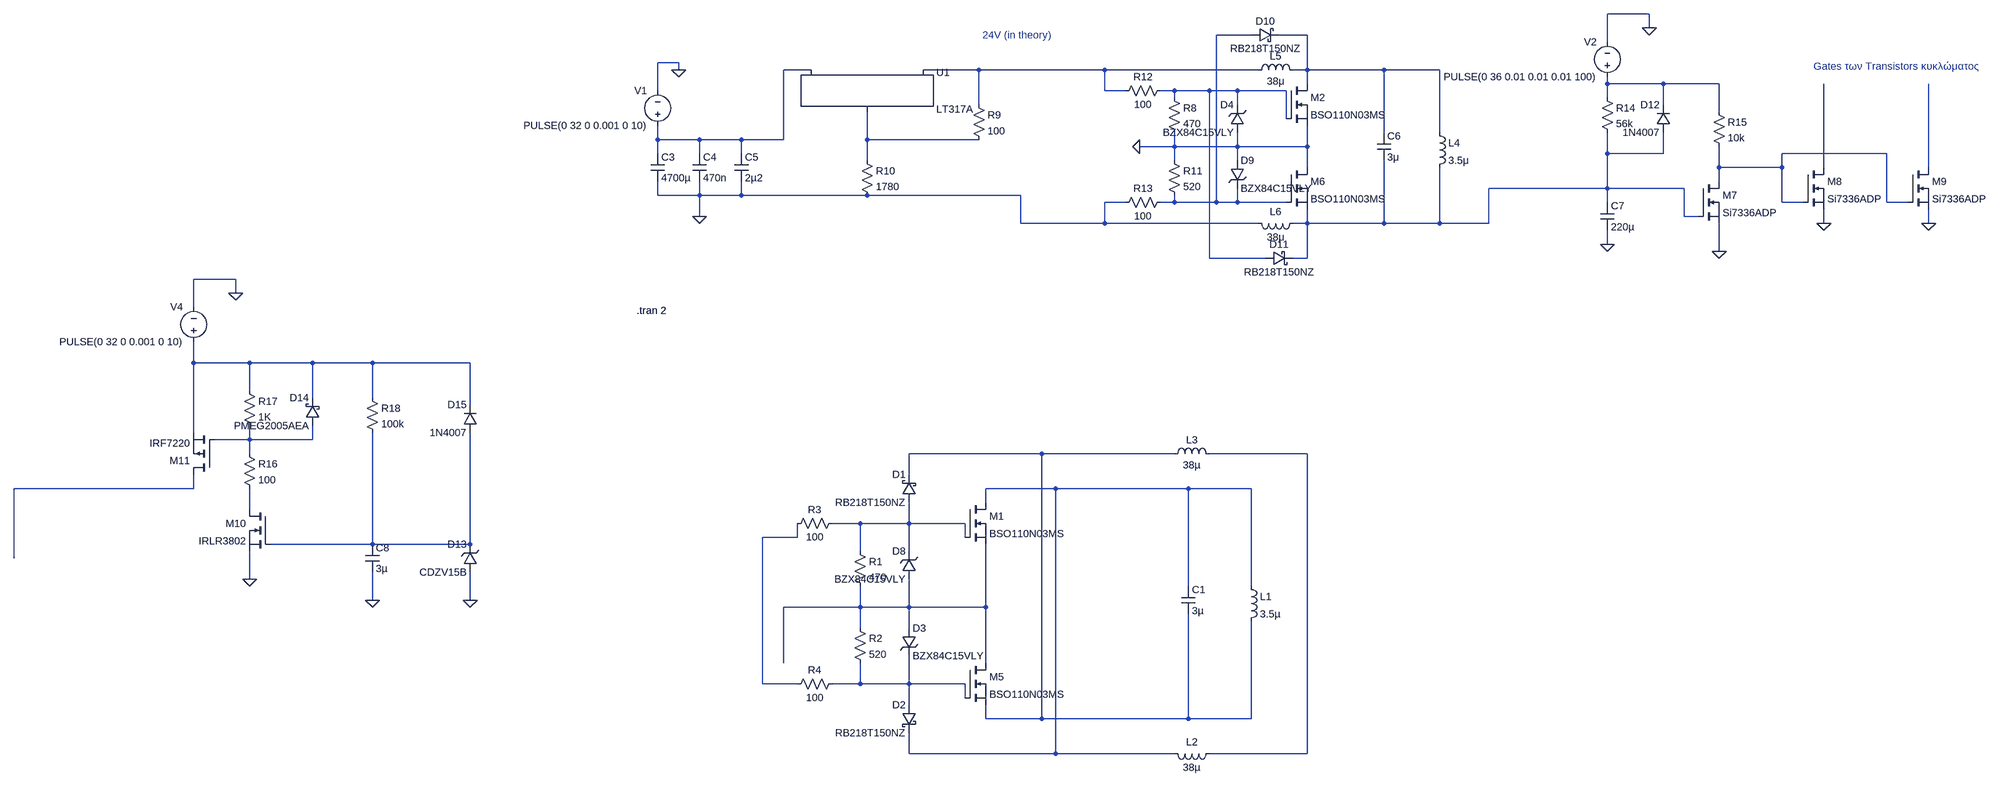
[diagram p0: schematic new_combined_stillwrong.asc]
new_combined_stillwrong.asc, the LTspice schematic file:
Version 4.1
SHEET 1 2732 1648
WIRE 656 -96 560 -96
WIRE 656 -64 656 -96
WIRE -256 -48 -336 -48
WIRE -128 -48 -192 -48
WIRE 560 -32 560 -96
WIRE -1568 16 -1616 16
WIRE -1568 32 -1568 16
WIRE -1264 32 -1328 32
WIRE -880 32 -1008 32
WIRE -592 32 -880 32
WIRE -240 32 -592 32
WIRE -128 32 -128 -48
WIRE -128 32 -160 32
WIRE 48 32 -128 32
WIRE 176 32 48 32
WIRE -128 64 -128 32
WIRE 560 64 560 48
WIRE 688 64 560 64
WIRE 816 64 688 64
WIRE -1616 80 -1616 16
WIRE -592 80 -592 32
WIRE -544 80 -592 80
WIRE -432 80 -464 80
WIRE -352 80 -432 80
WIRE -288 80 -352 80
WIRE -176 80 -288 80
WIRE -432 96 -432 80
WIRE 560 96 560 64
WIRE -880 112 -880 32
WIRE -288 112 -288 80
WIRE 688 112 688 64
WIRE 816 128 816 64
WIRE -176 144 -176 80
WIRE 48 176 48 32
WIRE 176 176 176 32
WIRE -1616 192 -1616 160
WIRE -1520 192 -1616 192
WIRE -1424 192 -1520 192
WIRE -1328 192 -1328 32
WIRE -1328 192 -1424 192
WIRE -1136 192 -1136 128
WIRE -880 192 -1136 192
WIRE -432 208 -432 176
WIRE -432 208 -512 208
WIRE -288 208 -288 176
WIRE -288 208 -432 208
WIRE -128 208 -128 160
WIRE -128 208 -288 208
WIRE -1616 224 -1616 192
WIRE -1520 224 -1520 192
WIRE -1424 224 -1424 192
WIRE 560 224 560 176
WIRE 688 224 688 176
WIRE 688 224 560 224
WIRE 1200 224 960 224
WIRE -1136 240 -1136 192
WIRE -432 240 -432 208
WIRE -288 240 -288 208
WIRE -128 256 -128 208
WIRE 816 256 816 208
WIRE 960 256 960 224
WIRE 960 256 816 256
WIRE 1056 256 1056 64
WIRE 1296 256 1296 64
WIRE 816 288 816 256
WIRE 560 304 560 224
WIRE 560 304 288 304
WIRE 736 304 560 304
WIRE -1616 320 -1616 288
WIRE -1520 320 -1520 288
WIRE -1520 320 -1616 320
WIRE -1424 320 -1424 288
WIRE -1424 320 -1520 320
WIRE -1136 320 -1424 320
WIRE -784 320 -1136 320
WIRE -544 336 -592 336
WIRE -432 336 -432 320
WIRE -432 336 -464 336
WIRE -336 336 -336 -48
WIRE -336 336 -432 336
WIRE -288 336 -288 304
WIRE -288 336 -336 336
WIRE -176 336 -288 336
WIRE 560 336 560 304
WIRE 960 336 960 256
WIRE 1008 336 960 336
WIRE 1200 336 1200 224
WIRE 1248 336 1200 336
WIRE -1520 368 -1520 320
WIRE 736 368 736 304
WIRE 768 368 736 368
WIRE -784 384 -784 320
WIRE -592 384 -592 336
WIRE -592 384 -784 384
WIRE -240 384 -592 384
WIRE -128 384 -128 352
WIRE -128 384 -160 384
WIRE 48 384 48 240
WIRE 48 384 -128 384
WIRE 176 384 176 256
WIRE 176 384 48 384
WIRE 288 384 288 304
WIRE 288 384 176 384
WIRE 1056 384 1056 352
WIRE 1296 384 1296 352
WIRE 560 432 560 400
WIRE 816 448 816 384
WIRE -352 464 -352 80
WIRE -224 464 -352 464
WIRE -128 464 -128 384
WIRE -128 464 -160 464
WIRE -2608 512 -2704 512
WIRE -2608 544 -2608 512
WIRE -2704 576 -2704 512
WIRE -2704 704 -2704 656
WIRE -2576 704 -2704 704
WIRE -2432 704 -2576 704
WIRE -2288 704 -2432 704
WIRE -2064 704 -2288 704
WIRE -2576 768 -2576 704
WIRE -2432 784 -2432 704
WIRE -2288 784 -2288 704
WIRE -2064 800 -2064 704
WIRE -2704 864 -2704 704
WIRE -2576 880 -2576 848
WIRE -2576 880 -2656 880
WIRE -2432 880 -2432 848
WIRE -2432 880 -2576 880
WIRE -2576 912 -2576 880
WIRE -736 912 -1040 912
WIRE -432 912 -736 912
WIRE -128 912 -352 912
WIRE -1040 960 -1040 912
WIRE -2704 992 -2704 960
WIRE -2704 992 -3216 992
WIRE -704 992 -864 992
WIRE -400 992 -704 992
WIRE -256 992 -400 992
WIRE -864 1024 -864 992
WIRE -2576 1040 -2576 992
WIRE -1152 1072 -1216 1072
WIRE -1040 1072 -1040 1024
WIRE -1040 1072 -1152 1072
WIRE -912 1072 -1040 1072
WIRE -1296 1104 -1296 1072
WIRE -1296 1104 -1376 1104
WIRE -912 1104 -912 1072
WIRE -2288 1120 -2288 864
WIRE -2288 1120 -2528 1120
WIRE -2064 1120 -2064 864
WIRE -2064 1120 -2288 1120
WIRE -1152 1136 -1152 1072
WIRE -1040 1136 -1040 1072
WIRE -3216 1152 -3216 992
WIRE -2576 1200 -2576 1136
WIRE -400 1216 -400 992
WIRE -256 1216 -256 992
WIRE -2288 1248 -2288 1184
WIRE -2064 1248 -2064 1184
WIRE -1152 1264 -1152 1216
WIRE -1152 1264 -1328 1264
WIRE -1040 1264 -1040 1200
WIRE -1040 1264 -1152 1264
WIRE -864 1264 -864 1120
WIRE -864 1264 -1040 1264
WIRE -1152 1312 -1152 1264
WIRE -1040 1312 -1040 1264
WIRE -1328 1392 -1328 1264
WIRE -864 1392 -864 1264
WIRE -1376 1440 -1376 1104
WIRE -1296 1440 -1376 1440
WIRE -1152 1440 -1152 1392
WIRE -1152 1440 -1216 1440
WIRE -1040 1440 -1040 1376
WIRE -1040 1440 -1152 1440
WIRE -912 1440 -1040 1440
WIRE -912 1472 -912 1440
WIRE -1040 1488 -1040 1440
WIRE -864 1520 -864 1488
WIRE -736 1520 -736 912
WIRE -736 1520 -864 1520
WIRE -400 1520 -400 1280
WIRE -400 1520 -736 1520
WIRE -256 1520 -256 1296
WIRE -256 1520 -400 1520
WIRE -1040 1600 -1040 1552
WIRE -704 1600 -704 992
WIRE -704 1600 -1040 1600
WIRE -432 1600 -704 1600
WIRE -128 1600 -128 912
WIRE -128 1600 -352 1600
FLAG -1568 32 0
FLAG -1520 368 0
FLAG -512 208 0
FLAG 656 -64 0
FLAG 560 432 0
FLAG 816 448 0
FLAG 1296 384 0
FLAG 1056 384 0
FLAG -2576 1200 0
FLAG -2288 1248 0
FLAG -2064 1248 0
FLAG -2608 544 0
SYMBOL cap -416 1216 R0
SYMATTR InstName C1
SYMATTR Value 3µ
SYMBOL ind -272 1200 R0
SYMATTR InstName L1
SYMATTR Value 3.5µ
SYMBOL ind -336 1584 R90
WINDOW 0 5 56 VBottom 2
WINDOW 3 32 56 VTop 2
SYMATTR InstName L2
SYMATTR Value 38µ
SYMBOL ind -448 928 R270
WINDOW 0 32 56 VTop 2
WINDOW 3 5 56 VBottom 2
SYMATTR InstName L3
SYMATTR Value 38µ
SYMBOL nmos -912 1024 R0
SYMATTR InstName M1
SYMATTR Value BSO110N03MS
SYMBOL schottky -1024 1024 R180
WINDOW 0 24 64 Left 2
WINDOW 3 24 0 Left 2
SYMATTR InstName D1
SYMATTR Value RB218T150NZ
SYMATTR Description Diode
SYMATTR Type diode
SYMBOL res -1168 1120 R0
SYMATTR InstName R1
SYMATTR Value 470
SYMBOL res -1168 1296 R0
SYMATTR InstName R2
SYMATTR Value 520
SYMBOL res -1200 1056 R90
WINDOW 0 0 56 VBottom 2
WINDOW 3 32 56 VTop 2
SYMATTR InstName R3
SYMATTR Value 100
SYMBOL res -1200 1424 R90
WINDOW 0 0 56 VBottom 2
WINDOW 3 32 56 VTop 2
SYMATTR InstName R4
SYMATTR Value 100
SYMBOL cap -1632 224 R0
SYMATTR InstName C3
SYMATTR Value 4700µ
SYMBOL cap -1536 224 R0
SYMATTR InstName C4
SYMATTR Value 470n
SYMBOL cap -1440 224 R0
SYMATTR InstName C5
SYMATTR Value 2µ2
SYMBOL res -896 96 R0
SYMATTR InstName R9
SYMATTR Value 100
SYMBOL PowerProducts\\LT317A -1136 32 R0
SYMATTR InstName U1
SYMBOL res -1152 224 R0
SYMATTR InstName R10
SYMATTR Value 1780
SYMBOL nmos -912 1392 R0
SYMATTR InstName M5
SYMATTR Value BSO110N03MS
SYMBOL voltage -1616 176 R180
WINDOW 0 24 96 Left 2
WINDOW 3 24 16 Left 2
WINDOW 123 0 0 Left 0
WINDOW 39 0 0 Left 0
SYMATTR InstName V1
SYMATTR Value PULSE(0 32 0 0.001 0 10)
SYMBOL schottky -1024 1488 M0
SYMATTR InstName D2
SYMATTR Value RB218T150NZ
SYMATTR Description Diode
SYMATTR Type diode
SYMBOL zener -1024 1200 R180
WINDOW 0 24 64 Left 2
WINDOW 3 24 0 Left 2
SYMATTR InstName D8
SYMATTR Value BZX84C15VLY
SYMATTR Description Diode
SYMATTR Type diode
SYMBOL zener -1056 1312 R0
SYMATTR InstName D3
SYMATTR Value BZX84C15VLY
SYMATTR Description Diode
SYMATTR Type diode
SYMBOL cap 32 176 R0
SYMATTR InstName C6
SYMATTR Value 3μ
SYMBOL ind 160 160 R0
SYMATTR InstName L4
SYMATTR Value 3.5μ
SYMATTR SpiceLine Rser=1m
SYMBOL nmos -176 64 R0
SYMATTR InstName M2
SYMATTR Value BSO110N03MS
SYMBOL nmos -176 256 R0
SYMATTR InstName M6
SYMATTR Value BSO110N03MS
SYMBOL zener -272 176 R180
WINDOW 0 24 64 Left 2
WINDOW 3 24 0 Left 2
SYMATTR InstName D4
SYMATTR Value BZX84C15VLY
SYMATTR Description Diode
SYMATTR Type diode
SYMBOL zener -304 240 R0
SYMATTR InstName D9
SYMATTR Value BZX84C15VLY
SYMATTR Description Diode
SYMATTR Type diode
SYMBOL ind -256 48 R270
WINDOW 0 32 56 VTop 2
WINDOW 3 5 56 VBottom 2
SYMATTR InstName L5
SYMATTR Value 38μ
SYMATTR SpiceLine Rser=1m
SYMBOL ind -144 368 R90
WINDOW 0 5 56 VBottom 2
WINDOW 3 32 56 VTop 2
SYMATTR InstName L6
SYMATTR Value 38μ
SYMATTR SpiceLine Rser=1m
SYMBOL res -448 80 R0
SYMATTR InstName R8
SYMATTR Value 470
SYMBOL res -448 224 R0
SYMATTR InstName R11
SYMATTR Value 520
SYMBOL res -448 64 R90
WINDOW 0 0 56 VBottom 2
WINDOW 3 32 56 VTop 2
SYMATTR InstName R12
SYMATTR Value 100
SYMBOL res -448 320 R90
WINDOW 0 0 56 VBottom 2
WINDOW 3 32 56 VTop 2
SYMATTR InstName R13
SYMATTR Value 100
SYMBOL schottky -256 -32 R270
WINDOW 0 32 32 VTop 2
WINDOW 3 0 32 VBottom 2
SYMATTR InstName D10
SYMATTR Value RB218T150NZ
SYMATTR Description Diode
SYMATTR Type diode
SYMBOL schottky -224 448 M90
WINDOW 0 0 32 VBottom 2
WINDOW 3 32 32 VTop 2
SYMATTR InstName D11
SYMATTR Value RB218T150NZ
SYMATTR Description Diode
SYMATTR Type diode
SYMBOL voltage 560 64 R180
WINDOW 0 24 96 Left 2
WINDOW 3 24 16 Left 2
WINDOW 123 0 0 Left 0
WINDOW 39 0 0 Left 0
SYMATTR InstName V2
SYMATTR Value PULSE(0 36 0.01 0.01 0.01 100)
SYMBOL res 544 80 R0
SYMATTR InstName R14
SYMATTR Value 56k
SYMBOL diode 704 176 R180
WINDOW 0 24 64 Left 2
WINDOW 3 24 0 Left 2
SYMATTR InstName D12
SYMATTR Value 1N4007
SYMBOL res 800 112 R0
SYMATTR InstName R15
SYMATTR Value 10k
SYMBOL cap 544 336 R0
SYMATTR InstName C7
SYMATTR Value 220µ
SYMBOL nmos 768 288 R0
SYMATTR InstName M7
SYMATTR Value Si7336ADP
SYMBOL nmos 1008 256 R0
SYMATTR InstName M8
SYMATTR Value Si7336ADP
SYMBOL nmos 1248 256 R0
SYMATTR InstName M9
SYMATTR Value Si7336ADP
SYMBOL cap -2304 1120 R0
SYMATTR InstName C8
SYMATTR Value 3µ
SYMATTR SpiceLine V=50 Irms=10.2 Rser=0.027 Lser=0
SYMBOL zener -2048 1184 R180
WINDOW 0 24 64 Left 2
WINDOW 3 24 0 Left 2
SYMATTR InstName D13
SYMATTR Value CDZV15B
SYMATTR Description Diode
SYMATTR Type diode
SYMBOL nmos -2528 1040 M0
SYMATTR InstName M10
SYMATTR Value IRLR3802
SYMBOL res -2592 896 R0
SYMATTR InstName R16
SYMATTR Value 100
SYMATTR SpiceLine tol=1 pwr=0.1
SYMBOL res -2592 752 R0
SYMATTR InstName R17
SYMATTR Value 1K
SYMATTR SpiceLine tol=1 pwr=0.1
SYMBOL schottky -2416 848 R180
WINDOW 0 24 64 Left 2
WINDOW 3 24 0 Left 2
SYMATTR InstName D14
SYMATTR Value PMEG2005AEA
SYMATTR Description Diode
SYMATTR Type diode
SYMBOL res -2304 768 R0
SYMATTR InstName R18
SYMATTR Value 100k
SYMATTR SpiceLine tol=1 pwr=0.1
SYMBOL diode -2048 864 R180
WINDOW 0 24 64 Left 2
WINDOW 3 24 0 Left 2
SYMATTR InstName D15
SYMATTR Value 1N4007
SYMBOL pmos -2656 960 R180
SYMATTR InstName M11
SYMATTR Value IRF7220
SYMBOL voltage -2704 672 R180
WINDOW 0 24 96 Left 2
WINDOW 3 24 16 Left 2
WINDOW 123 0 0 Left 0
WINDOW 39 0 0 Left 0
SYMATTR InstName V4
SYMATTR Value PULSE(0 32 0 0.001 0 10)
TEXT -872 -48 Left 2 ;24V (in theory)
TEXT -1664 584 Left 2 !.tran 2
TEXT 1032 24 Left 2 ;Gates των Transistors κυκλώματος

The netlist it stands for:
* new_combined_stillwrong.asc
C1 N017 N014 3µ
L1 N017 N014 3.5µ
L2 N015 N017 38µ
L3 N014 N015 38µ
M1 N017 N019 N022 N022 BSO110N03MS
D1 N019 N014 RB218T150NZ
R1 N019 N022 470
R2 N022 N023 520
R3 N019 N020 100
R4 N023 N020 100
C3 N003 0 4700µ
C4 N003 0 470n
C5 N003 0 2µ2
R9 N004 N007 100
X§U1 N007 N004 N003 LT317A
R10 N007 0 1780
M5 N022 N023 N014 N014 BSO110N03MS
V1 N003 0 PULSE(0 32 0 0.001 0 10)
D2 N023 N017 RB218T150NZ
D8 N022 N019 BZX84C15VLY
D3 N022 N023 BZX84C15VLY
C6 N002 N008 3μ
L4 N002 N008 3.5μ Rser=1m
M2 N002 N006 0 0 BSO110N03MS
M6 0 N001 N008 N008 BSO110N03MS
D4 0 N006 BZX84C15VLY
D9 0 N001 BZX84C15VLY
L5 N004 N002 38μ Rser=1m
L6 N008 0 38μ Rser=1m
R8 N006 0 470
R11 0 N001 520
R12 N006 N004 100
R13 N001 0 100
D10 N001 N002 RB218T150NZ
D11 N006 N008 RB218T150NZ
V2 N005 0 PULSE(0 36 0.01 0.01 0.01 100)
R14 N005 N008 56k
D12 N008 N005 1N4007
R15 N005 N009 10k
C7 N008 0 220µ
M7 N009 N008 0 0 Si7336ADP
M8 N010 N009 0 0 Si7336ADP
M9 N011 N009 0 0 Si7336ADP
C8 N021 0 3µ V=50 Irms=10.2 Rser=0.027 Lser=0
D13 0 N021 CDZV15B
M10 N018 N021 0 0 IRLR3802
R16 N013 N018 100 tol=1 pwr=0.1
R17 N012 N013 1K tol=1 pwr=0.1
D14 N013 N012 PMEG2005AEA
R18 N012 N021 100k tol=1 pwr=0.1
D15 N021 N012 1N4007
M11 N016 N013 N012 N012 IRF7220
V4 N012 0 PULSE(0 32 0 0.001 0 10)
.model D D
.lib standard.dio
.model NMOS NMOS
.model PMOS PMOS
.lib standard.mos
* 24V (in theory)
.tran 2
* Gates των Transistors κυκλώματος
.lib LTC.lib
.backanno
.end